# Altium schematic sheet Switch.SchDoc
size A4
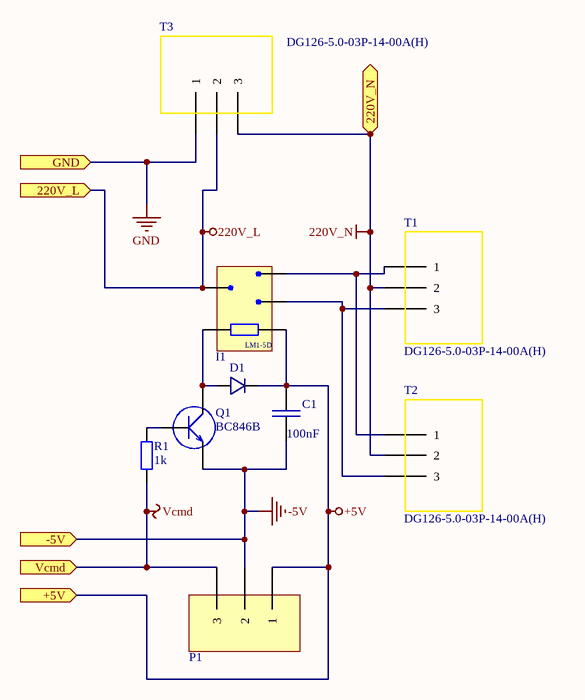
[diagram p0: Switch.SchDoc]

## Parts
C1  100nF  [SMD-0805]
D1  BAS16  [SOT-23]  (value not drawn)
I1  I-LM1-5D  [LM1-5D]  (value not drawn)
P1  Pins 3  [THT3-254]  (value not drawn)
Q1  BC846B  [SOT-23]
R1  1K  [SMD-0805]
T1  DG126-5.0-03P-14-00A(H)  [DG126-5.0-03P-14-00A(H)]
T2  DG126-5.0-03P-14-00A(H)  [DG126-5.0-03P-14-00A(H)]
T3  DG126-5.0-03P-14-00A(H)  [DG126-5.0-03P-14-00A(H)]

## Ports
220V_L (in), 220V_N (in), +5V (in), -5V (in), GND (in), Vcmd (in)

## Nets
220V_L: I1.3 T3.2 ; port 220V_L
220V_N: T1.2 T2.2 T3.3 ; port 220V_N
+5V: C1.1 D1.1(C) I1.1 P1.1 ; port +5V
-5V: C1.2 P1.2 Q1.2(E) ; port -5V
GND: T3.1 ; port GND
Vcmd: P1.3 R1.2 ; port Vcmd
NetD1_3: D1.3(A) I1.2 Q1.3(C)
NetI1_4: I1.4 T1.1 T2.1
NetI1_5: I1.5 T1.3 T2.3
NetQ1_1: Q1.1(B) R1.1

## Library data of the parts
C1 = C-100nF-0805: Condensator: ceramic; 100nF; 50V; X7R; ±10%; SMD; 0805; -55÷125°C; MinQuantity: 10; Code: AVX 08055C104KAT2A; Cost: 0.031; Link: http://www.tme.eu/ro/details/08055c104kat2a/condensatoare-mlcc-smd-0805/avx/#; Value: 100nF
D1 = BAS16: Dioda: comutatie; 75V; 50mA; 100mA; SOT23; 6ns; MinQuantity: 25; Code: NXP BAS16.215; Cost: 0.072; Link: http://www.tme.eu/ro/details/bas16/diode-universale-smd/nxp/bas16215/#
I1 = I-LM1-5D: Releu: electromagnetic; SPDT; Ubobina:5VDC; 12A/250VAC; 12A/30VDC; MinQuantity: 1; Cost: 6.47; Link: http://www.tme.eu/ro/details/lm1-5d/relee-electromagnetice-miniatura/rayex-electronic/#; Code: LM1-5D
Q1 = BC846B: Tranzistor: bipolar, NPN; 65V; 100mA; SOT23; MinQuantity: 25; Cost: 0.072; Link: http://www.tme.eu/ro/details/bc846b/tranzistori-smd-npn/nxp/bc846b215
R1 = R-1K-0805: Rezistor: thick film; SMD; 0805; 1kO; 0,125W; ±5%; -55÷155°C; MinQuantity: 100; Code: RC0805JR-071KL; Cost: 0.027; Link: http://www.tme.eu/ro/details/rc0805jr-071k/rezistente-smd-0805/yageo/rc0805jr-071kl/#; Value: 1k
T1-T3 = DG126-5.0-03P-14-00A(H): Connector